# EAGLE schematic Temp Controller (EAGLE 6.3)
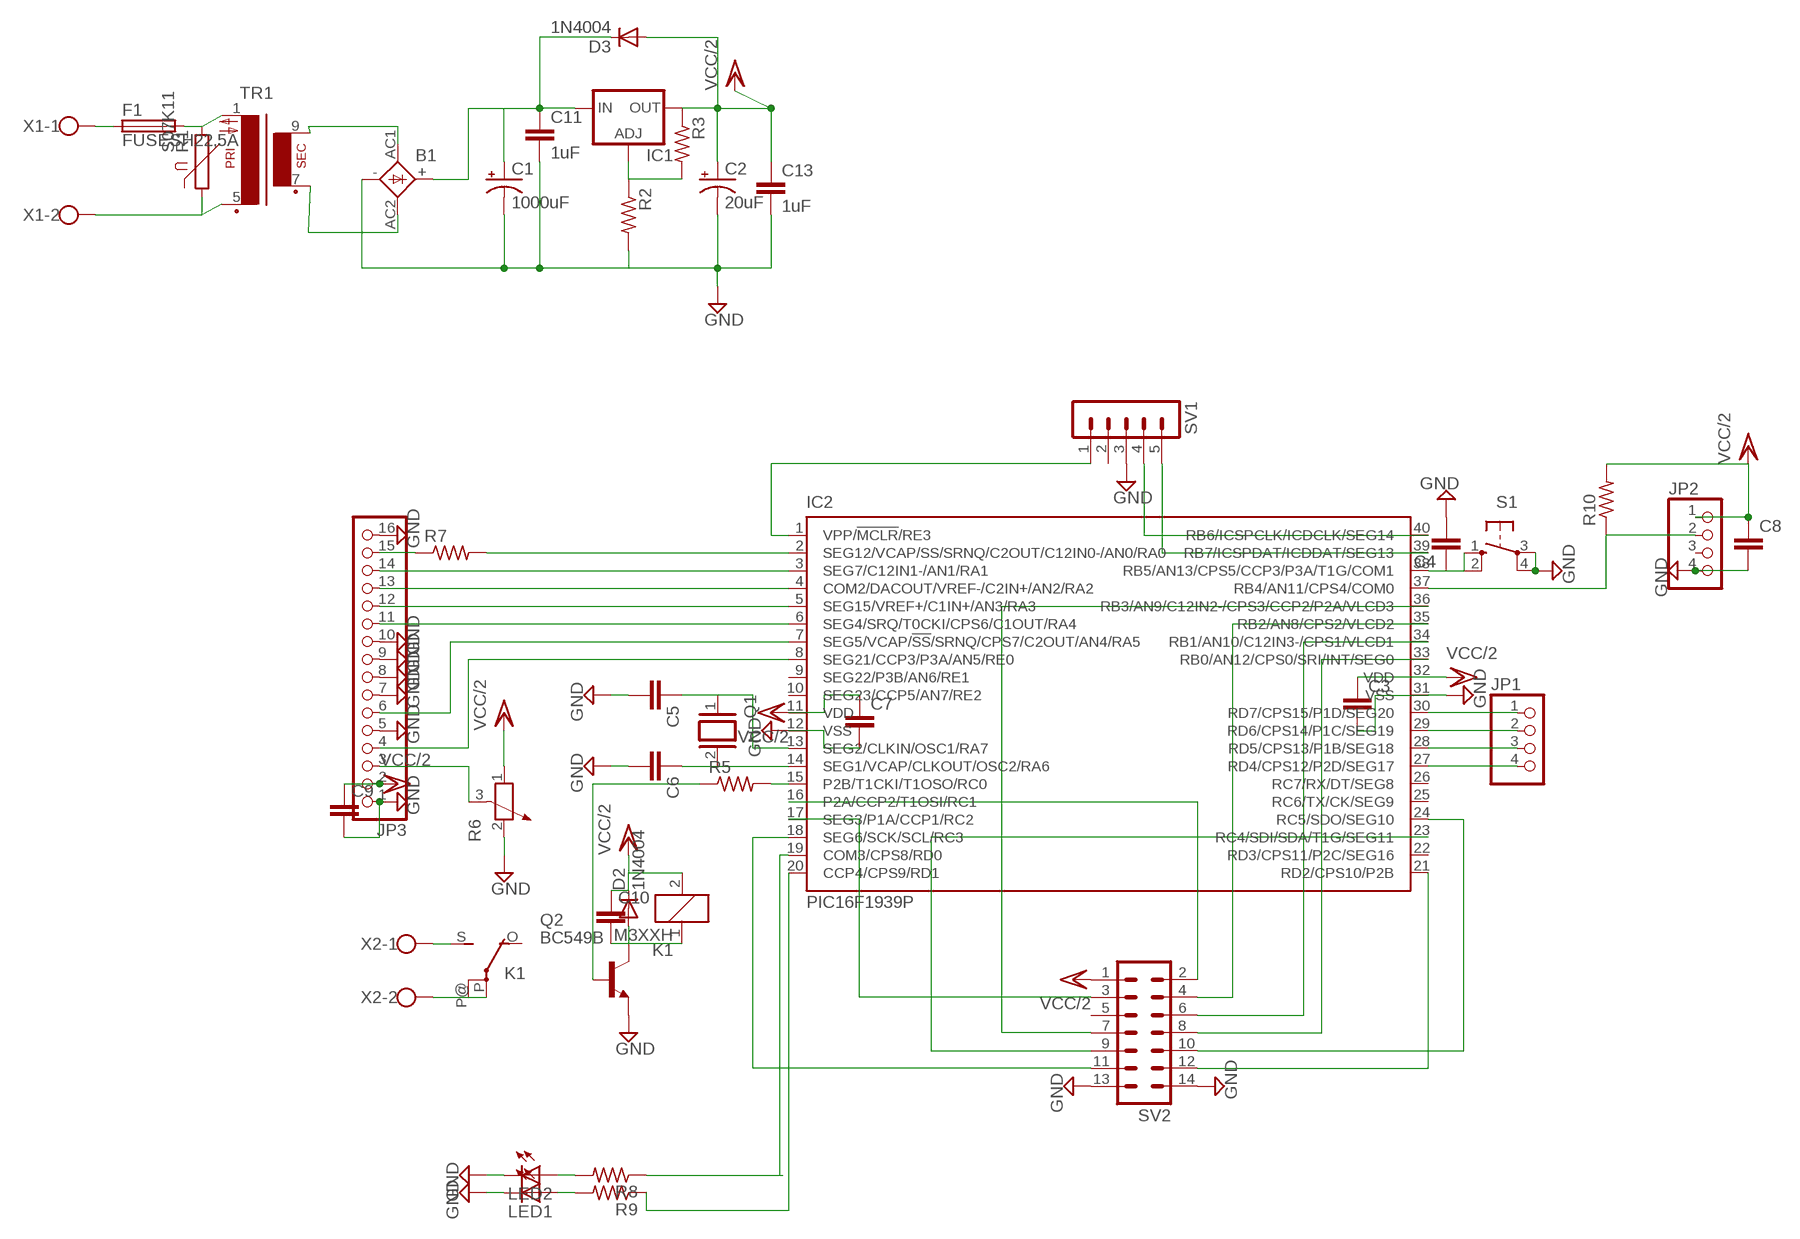
[diagram p0: schematic, sheet 1]

## Parts
B1  1KAB  [1KAB]
C1  1000uF  CPOL-USE5-13  [E5-13]
C2  20uF  CPOL-USE5-6  [E5-6]
C3  C-EU025-030X050  [C025-030X050]
C4  C-EU025-030X050  [C025-030X050]
C5  C2.5/2  [C2.5-2]
C6  C2.5/2  [C2.5-2]
C7  C-EU025-030X050  [C025-030X050]
C8  C-EU025-030X050  [C025-030X050]
C9  C-EU025-030X050  [C025-030X050]
C10  C-EU025-030X050  [C025-030X050]
C11  1uF  C-EU025-030X050  [C025-030X050]
C13  1uF  C-EU025-030X050  [C025-030X050]
D2  1N4004  [DO41-10]
D3  1N4004  [DO41-10]
F1  FUSESH22,5A  [SH22,5A]
IC1  LM317TS  [317TS]
IC2  PIC16F1939P  [DIL40]
JP1  PINHD-1X4  [1X04]
JP2  PINHD-1X4  [1X04]
JP3  PINHD-1X16  [1X16]
K1  M3XXH  [M3XXH]
LED1  LED3MM  [LED3MM]
LED2  LED3MM  [LED3MM]
Q1  XTAL/S  [QS]
Q2  BC549B  [TO92-EBC]
R1  S07K11  [S07K11]
R2  R-US_0207/10  [0207/10]
R3  R-US_0207/10  [0207/10]
R5  R-US_0207/10  [0207/10]
R6  POTENTIOMETER_PT-10  [PT-10]
R7  R-US_0207/10  [0207/10]
R8  R-US_0207/10  [0207/10]
R9  R-US_0207/10  [0207/10]
R10  R-US_0207/10  [0207/10]
S1  10-XX  [B3F-10XX]
SV1  MA05-1  [MA05-1]
SV2  MA07-2  [MA07-2]
TR1  VV11  [VV11]
X1  W237-02P  [W237-132]
X2  W237-02P  [W237-132]

## Nets
GND: B1.- C1.- C2.- C3.2 C4.2 C5.2 C6.2 C7.2 C8.2 C9.2 C11.2 C13.2 IC2.12(VSS) IC2.31(VSS) JP2.4 JP3.1 JP3.5 JP3.7 JP3.8 JP3.9 JP3.10 JP3.16 LED1.K(C) LED2.K(C) Q2.E R2.2 R6.2 S1.3(P) S1.4(P1) SV1.3 SV2.13 SV2.14
N$1: F1.1 X1.1
N$2: F1.2 R1.2 TR1.1
N$3: R1.1 TR1.5(P2) X1.2
N$4: IC2.33(RB0/AN12/CPS0/SRI/INT/SEG0) SV2.8
N$5: B1.AC1 TR1.9(S4)
N$6: B1.AC2 TR1.7(S3)
N$7: IC2.30(RD7/CPS15/P1D/SEG20) JP1.1
N$8: B1.+ C1.+ C11.1 D3.C IC1.3(IN)
N$9: IC2.34(RB1/AN10/C12IN3-/CPS1/VLCD1) SV2.6
N$10: IC2.18(SEG6/SCK/SCL/RC3) SV2.11
N$11: IC2.1(VPP/!MCLR!/RE3) SV1.1
N$12: IC2.40(RB6/ICSPCLK/ICDCLK/SEG14) SV1.4
N$13: IC2.39(RB7/ICSPDAT/ICDDAT/SEG13) SV1.5
N$14: C5.1 IC2.13(SEG2/CLKIN/OSC1/RA7) Q1.1
N$15: C6.1 IC2.14(SEG1/VCAP/CLKOUT/OSC2/RA6) Q1.2
N$16: IC2.2(SEG12/VCAP/SS/SRNQ/C2OUT/C12IN0-/AN0/RA0) R7.2
N$17: IC2.29(RD6/CPS14/P1C/SEG19) JP1.2
N$18: IC2.23(RC4/SDI/SDA/T1G/SEG11) SV2.9
N$19: IC2.24(RC5/SDO/SEG10) SV2.10
N$20: IC2.21(RD2/CPS10/P2B) SV2.12
N$21: IC2.16(P2A/CCP2/T1OSI/RC1) SV2.2
N$22: IC2.17(SEG3/P1A/CCP1/RC2) SV2.3
N$23: JP3.15 R7.1
N$24: IC2.36(RB3/AN9/C12IN2-/CPS3/CCP2/P2A/VLCD3) SV2.7
N$25: IC2.35(RB2/AN8/CPS2/VLCD2) SV2.4
N$26: IC2.3(SEG7/C12IN1-/AN1/RA1) JP3.14
N$27: IC2.4(COM2/DACOUT/VREF-/C2IN+/AN2/RA2) JP3.13
N$28: IC2.5(SEG15/VREF+/C1IN+/AN3/RA3) JP3.12
N$29: IC2.6(SEG4/SRQ/T0CKI/CPS6/C1OUT/RA4) JP3.11
N$30: IC2.7(SEG5/VCAP/!SS!/SRNQ/CPS7/C2OUT/AN4/RA5) JP3.6
N$31: IC2.8(SEG21/CCP3/P3A/AN5/RE0) JP3.4
N$32: JP3.3 R6.3
N$34: IC2.28(RD5/CPS13/P1B/SEG18) JP1.3
N$35: IC1.1(ADJ) R2.1 R3.2
N$36: LED1.A R9.2
N$37: LED2.A R8.2
N$38: IC2.27(RD4/CPS12/P2D/SEG17) JP1.4
N$40: IC2.20(CCP4/CPS9/RD1) R9.1
N$41: IC2.19(COM3/CPS8/RD0) R8.1
N$42: C4.1 IC2.38(RB5/AN13/CPS5/CCP3/P3A/T1G/COM1) S1.1(S) S1.2(S1)
N$43: C10.2 D2.A K1.1 Q2.C
N$44: IC2.15(P2B/T1CKI/T1OSO/RC0) R5.2
N$45: Q2.B R5.1
N$46: K1.S(2:S) X2.1
N$47: K1.P(2:P) K1.P@(2:P) X2.2
N$50: IC2.37(RB4/AN11/CPS4/COM0) JP2.2 R10.1
VCC/2: C2.+ C3.1 C7.1 C8.1 C9.1 C10.1 C13.1 D2.C D3.A IC1.2(OUT) IC2.11(VDD) IC2.32(VDD) JP2.1 JP3.2 K1.2 R3.1 R6.1 R10.2 SV2.1
Unconnected: IC2.9(SEG22/P3B/AN6/RE1) IC2.10(SEG23/CCP5/AN7/RE2) IC2.22(RD3/CPS11/P2C/SEG16) IC2.25(RC6/TX/CK/SEG9) IC2.26(RC7/RX/DT/SEG8) JP2.3 K1.O(2:O) SV1.2 SV2.5

## Library data of the parts
B1 = rectifier:1KAB: RECTIFIER grid 5,08 x 5,08 mm
C1 C2 = rcl:CPOL-US: POLARIZED CAPACITOR, American symbol
C3 C4 C7-C11 C13 = rcl:C-EU: CAPACITOR, European symbol
C5 C6 = capacitor-wima:C: CAPACITOR naming: grid - package width
D2 D3 = diode:1N4004: DIODE general purpose rectifier, 1 A
F1 = fuse:FUSE: Fuse; OC_FARNELL: unknown; OC_NEWARK: unknown
IC1 = v-reg:LM317TS: VOLTAGE REGULATOR
IC2 = microchip-update-2:PIC16F193*?: Flash-Based, 8-Bit CMOS Microcontrollers wtih LCD Driver and nanoWatt XLP Technology Auto generated by make-symbol-device-package-bsdl.ulp Rev. 33 Source: http://ww1.microchip.com/downloads/en/DeviceDoc/41364D.pdf
JP1 JP2 = nrf905:PINHD-1X4: PIN HEADER
JP3 = pinhead:PINHD-1X16: PIN HEADER
K1 = relay:M3XXH: RELAY 1 x switch
LED1 LED2 = led:LED: LED OSRAM: - CHIPLED LG R971, LG N971, LY N971, LG Q971, LY Q971, LO R971, LY R971 LH N974, LH R974 LS Q976, LO Q976, LY Q976 LO Q996 - Hyper CHIPLED LW Q18S LB Q993, LB Q99A, LB R99A - SideLED LS A670, LO A670, LY A670, LG A670, LP A670 LB A673, LV A673, LT A673, LW A673 LH A674 LY A675 LS A676, LA A676, LO A676, LY A676, LW A676 LS A679, LY A679, LG A679 - Hyper Micro SIDELED® LS Y876, LA Y876, LO Y876, LY Y876 LT Y87S - SmartLED LW L88C, LW L88S LB L89C, LB L89S, LG L890 LS L89K, LO L89K, LY L89K LS L896, LA L896, LO L896, LY L896 - TOPLED LS T670, LO T670, LY T670, LG T670, LP T670 LSG T670, LSP T670, LSY T670, LOP T670, LYG T670 LG T671, LOG T671, LSG T671 LB T673, LV T673, LT T673, LW T673 LH T674 LS T676, LA T676, LO T676, LY T676, LB T676, LH T676, LSB T676, LW T676 LB T67C, LV T67C, LT T67C, LS T67K, LO T67K, LY T67K, LW E67C LS E67B, LA E67B, LO E67B, LY E67B, LB E67C, LV E67C, LT E67C LW T67C LS T679, LY T679, LG T679 LS T770, LO T770, LY T770, LG T770, LP T770 LB T773, LV T773, LT T773, LW T773 LH T774 LS E675, LA E675, LY E675, LS T675 LS T776, LA T776, LO T776, LY T776, LB T776 LHGB T686 LT T68C, LB T68C - Hyper Mini TOPLED® LB M676 - Mini TOPLED Santana® LG M470 LS M47K, LO M47K, LY M47K Source: http://www.osram.convergy.de LUXEON: - LUMILED® LXK2-PW12-R00, LXK2-PW12-S00, LXK2-PW14-U00, LXK2-PW14-V00 LXK2-PM12-R00, LXK2-PM12-S00, LXK2-PM14-U00 LXK2-PE12-Q00, LXK2-PE12-R00, LXK2-PE12-S00, LXK2-PE14-T00, LXK2-PE14-U00 LXK2-PB12-K00, LXK2-PB12-L00, LXK2-PB12-M00, LXK2-PB14-N00, LXK2-PB14-P00, LXK2-PB14-Q00 LXK2-PR12-L00, LXK2-PR12-M00, LXK2-PR14-Q00, LXK2-PR14-R00 LXK2-PD12-Q00, LXK2-PD12-R00, LXK2-PD12-S00 LXK2-PH12-R00, LXK2-PH12-S00 LXK2-PL12-P00, LXK2-PL12-Q00, LXK2-PL12-R00 Source: www.luxeon.com KINGBRIGHT: KA-3528ASYC Source: www.kingbright.com
Q1 = special:XTAL/S: CRYSTAL
Q2 = transistor-npn:BC549*: NPN Transistor
R1 = varistor:S07K11: VARISTOR
R2 R3 R5 R7-R10 = resistor:R-US_: RESISTOR, American symbol
R6 = rcl:POTENTIOMETER_: Potentiometer
S1 = switch-omron:10-XX: OMRON SWITCH
SV1 = con-lstb:MA05-1: PIN HEADER
SV2 = con-lstb:MA07-2: PIN HEADER
TR1 = trafo:VV11: TRANSFORMER 1 primary winding, 1 secondary winding BLOCK
X1 X2 = con-wago-508:W237-02P: WAGO SREW CLAMP